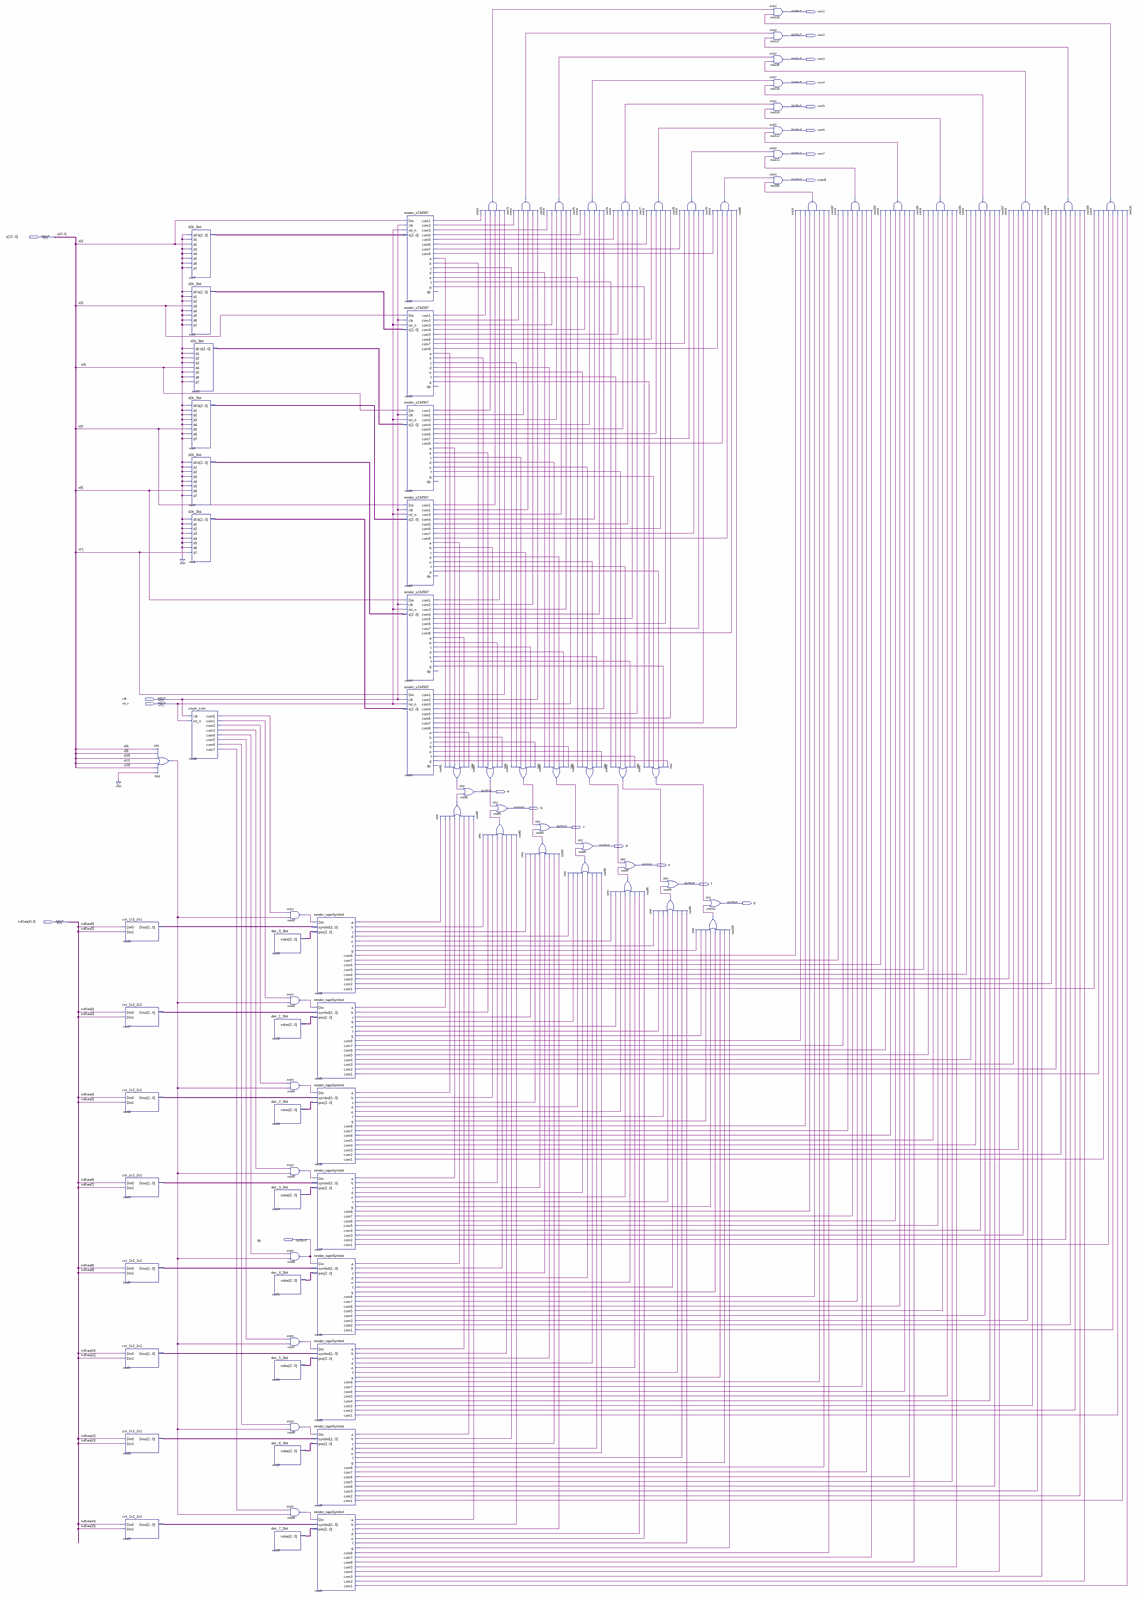
[diagram p0: schematic sheet, whole]
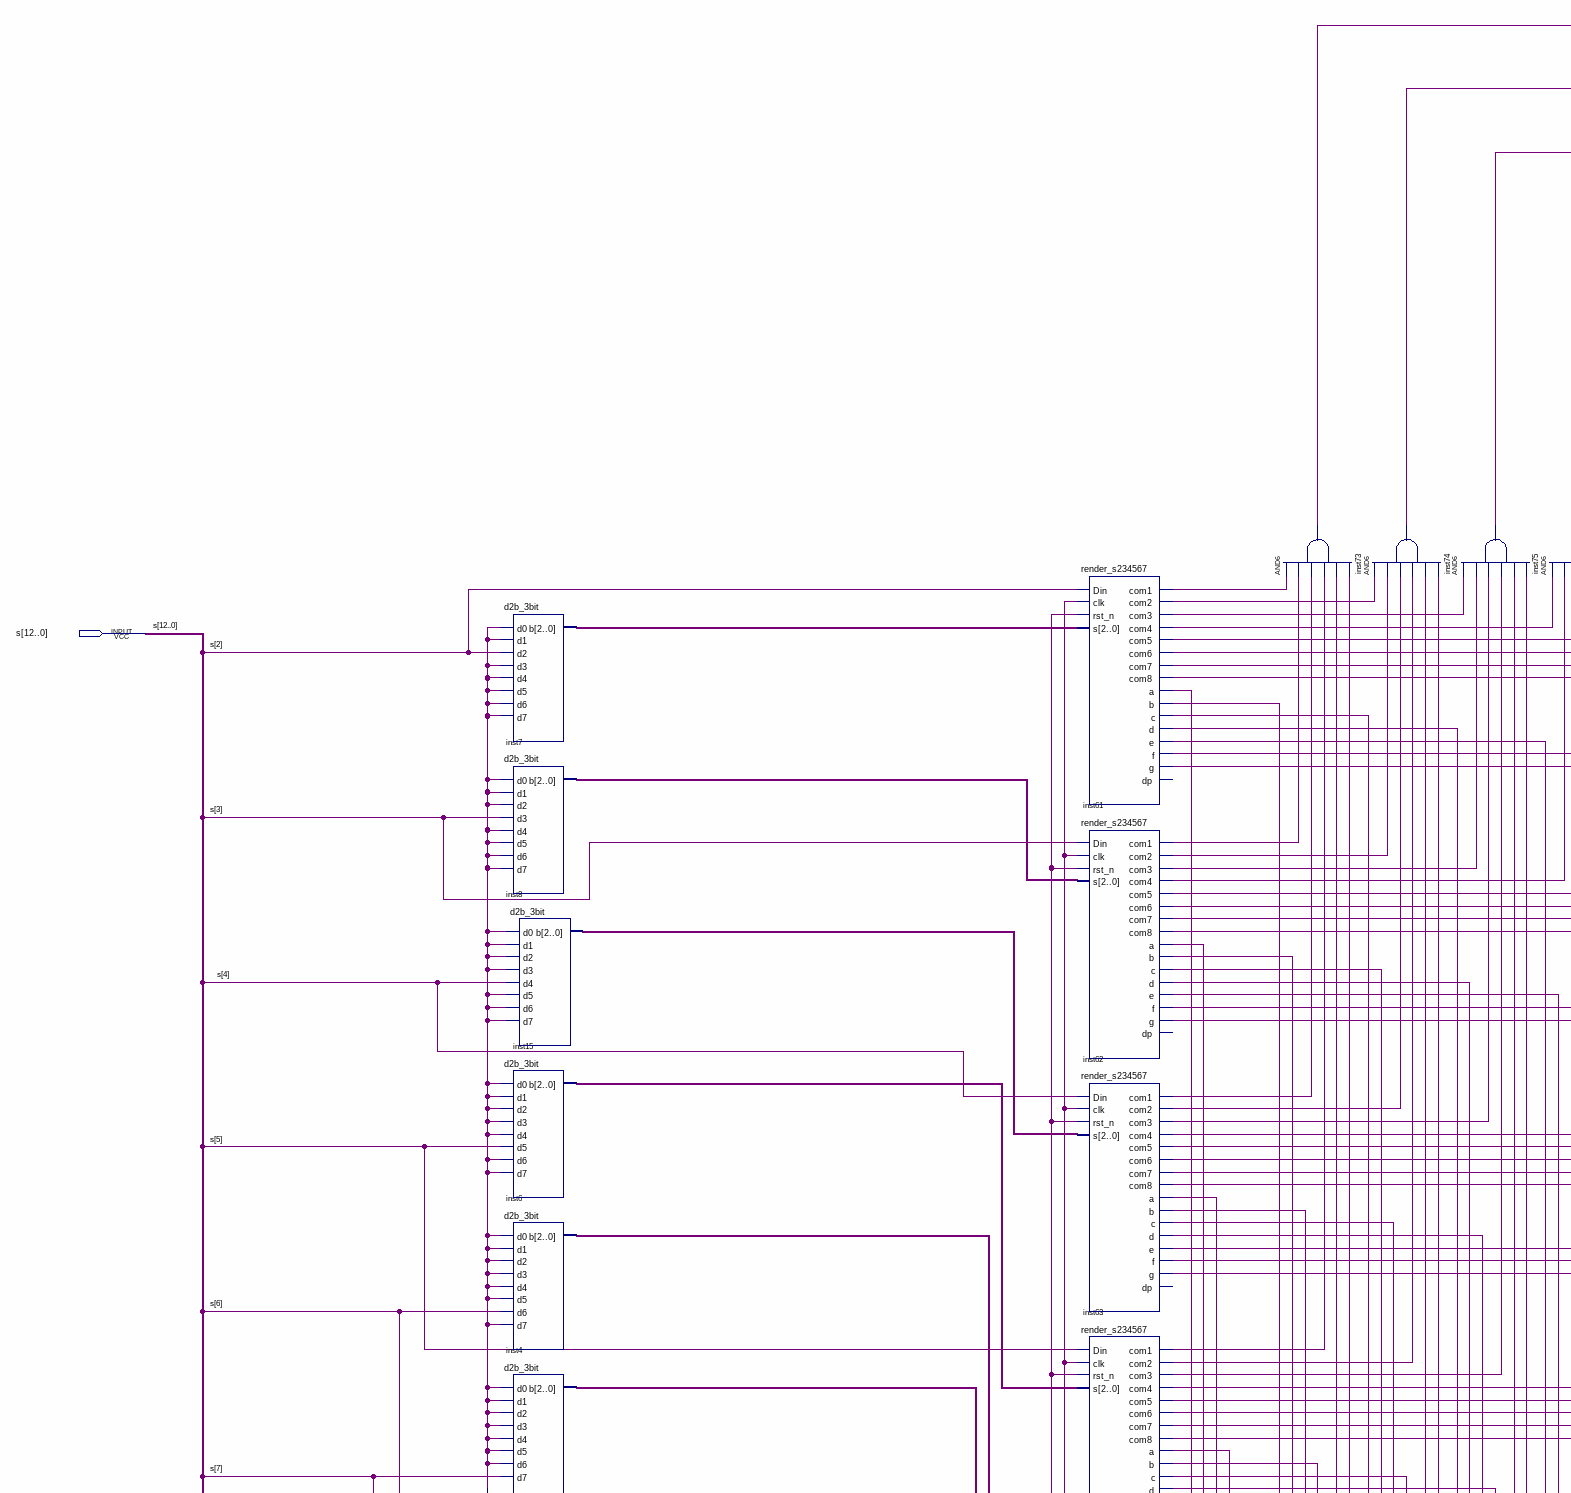
[diagram p1: schematic sheet, upper left part]
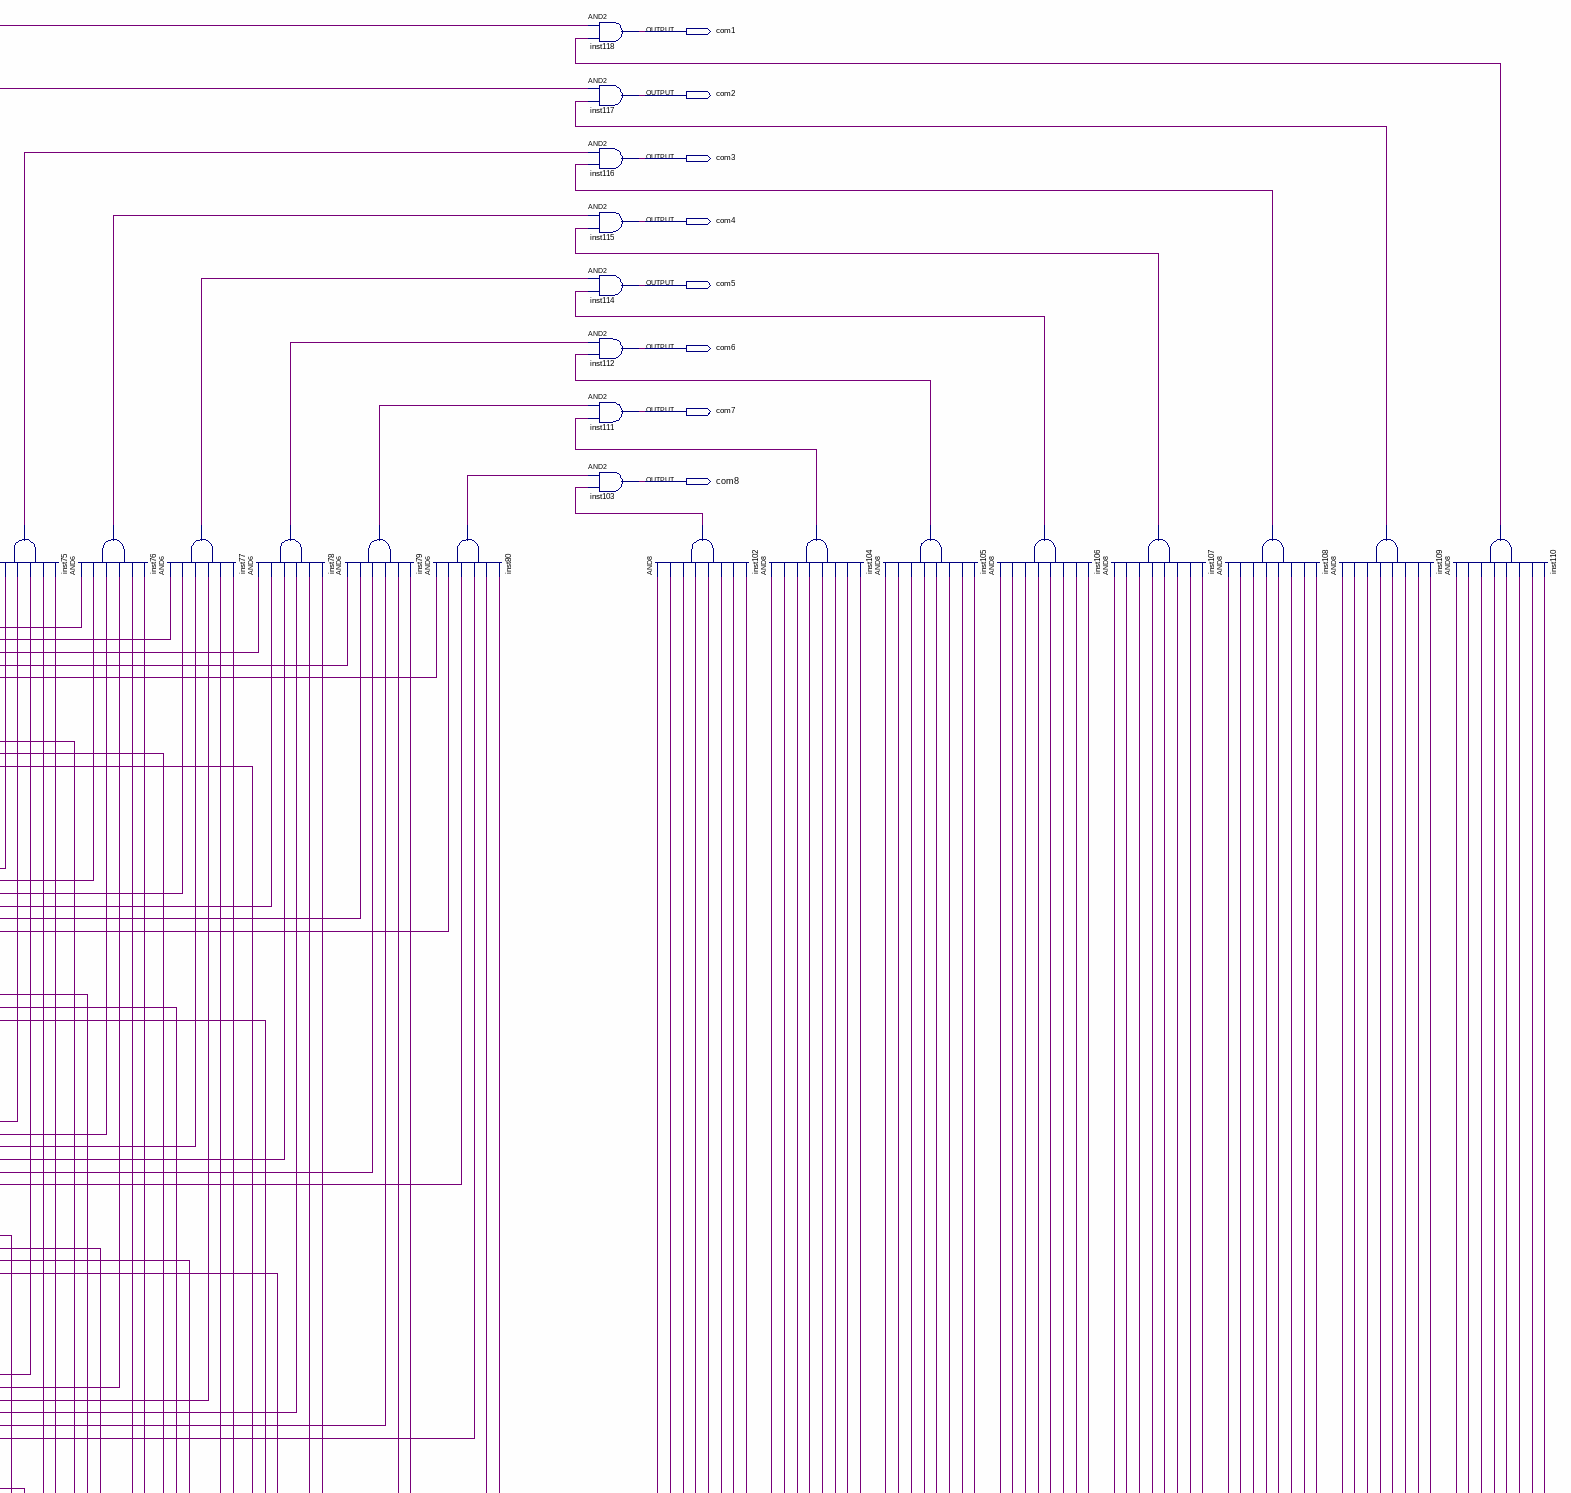
[diagram p2: schematic sheet, upper right part]
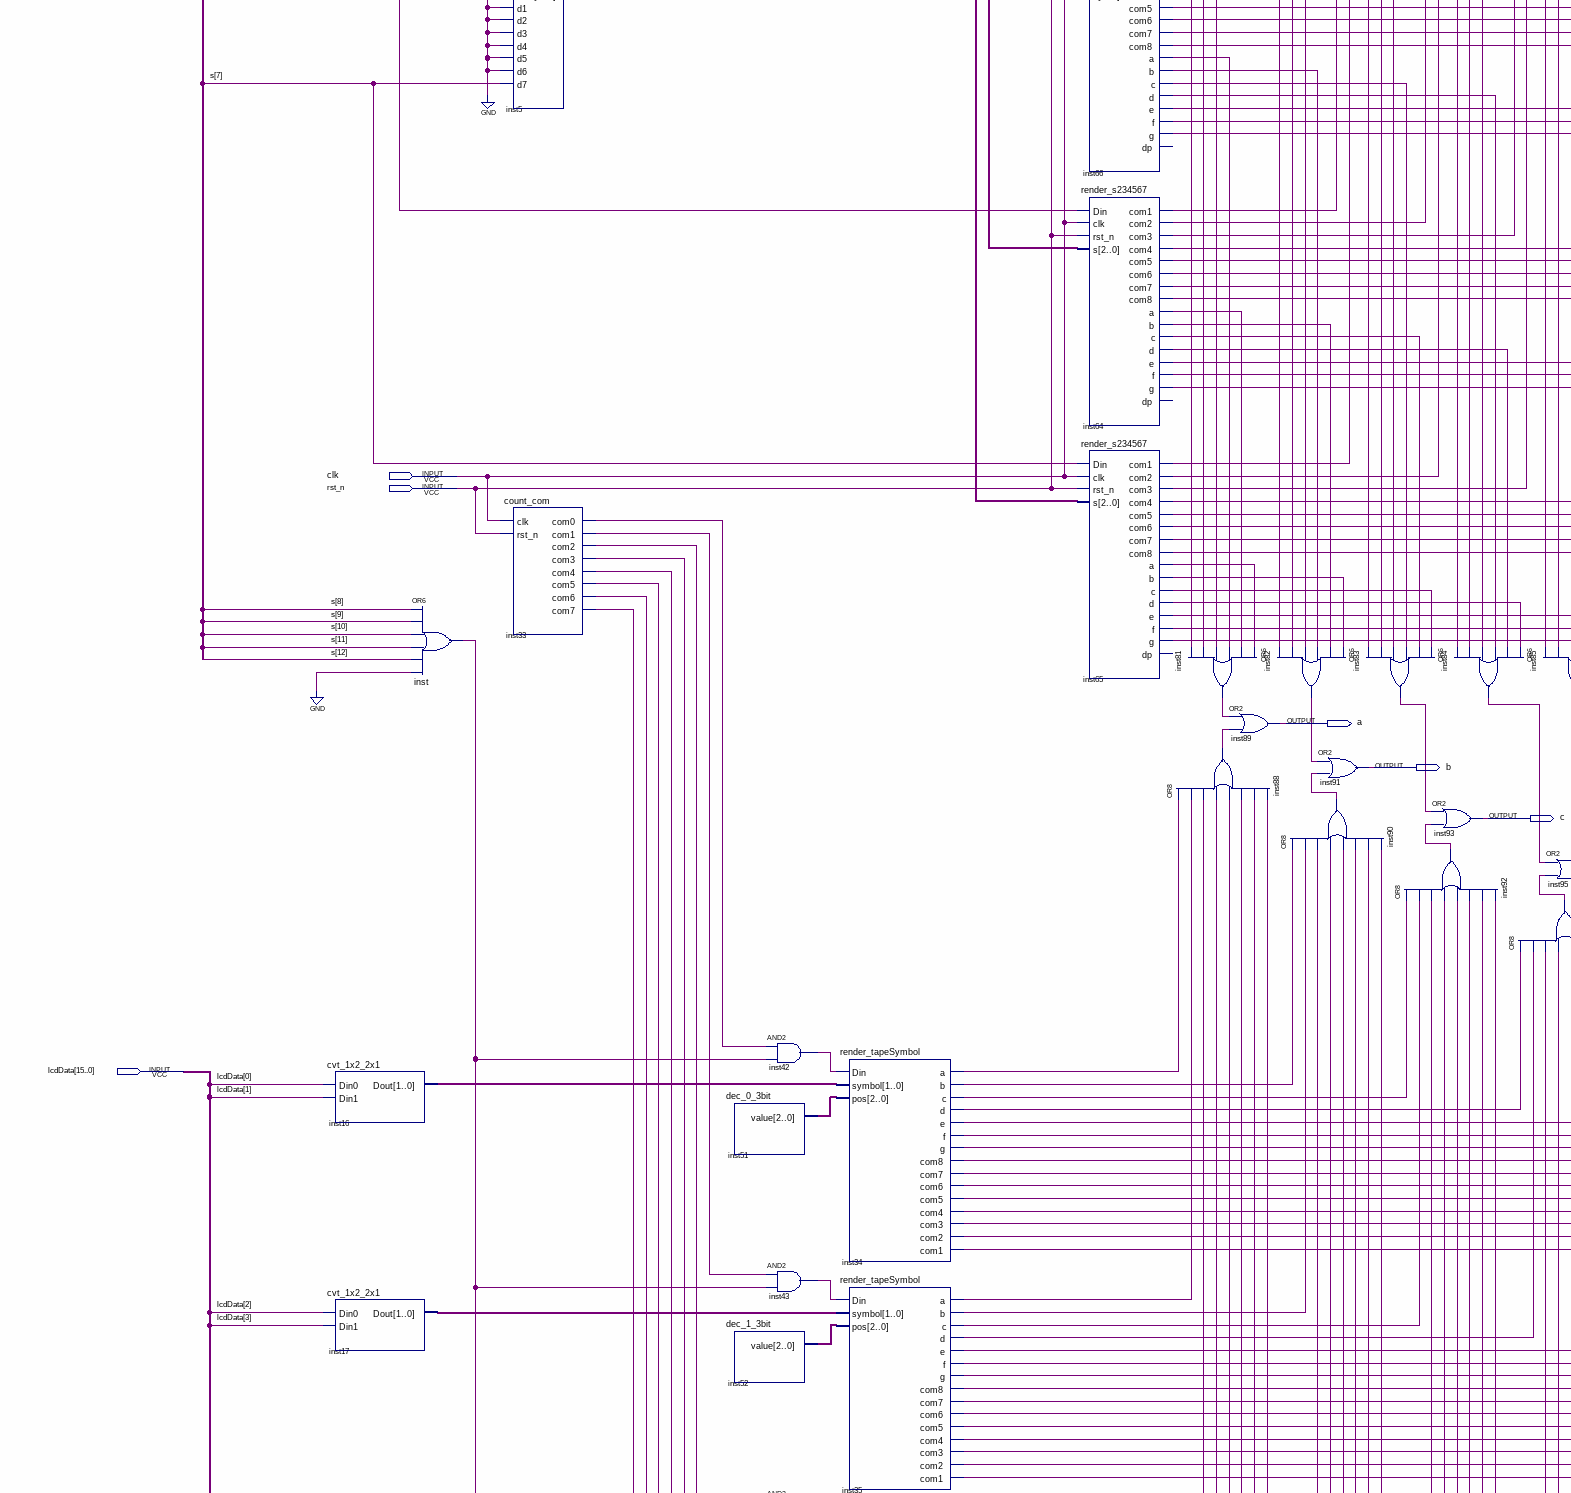
[diagram p3: schematic sheet, middle left part]
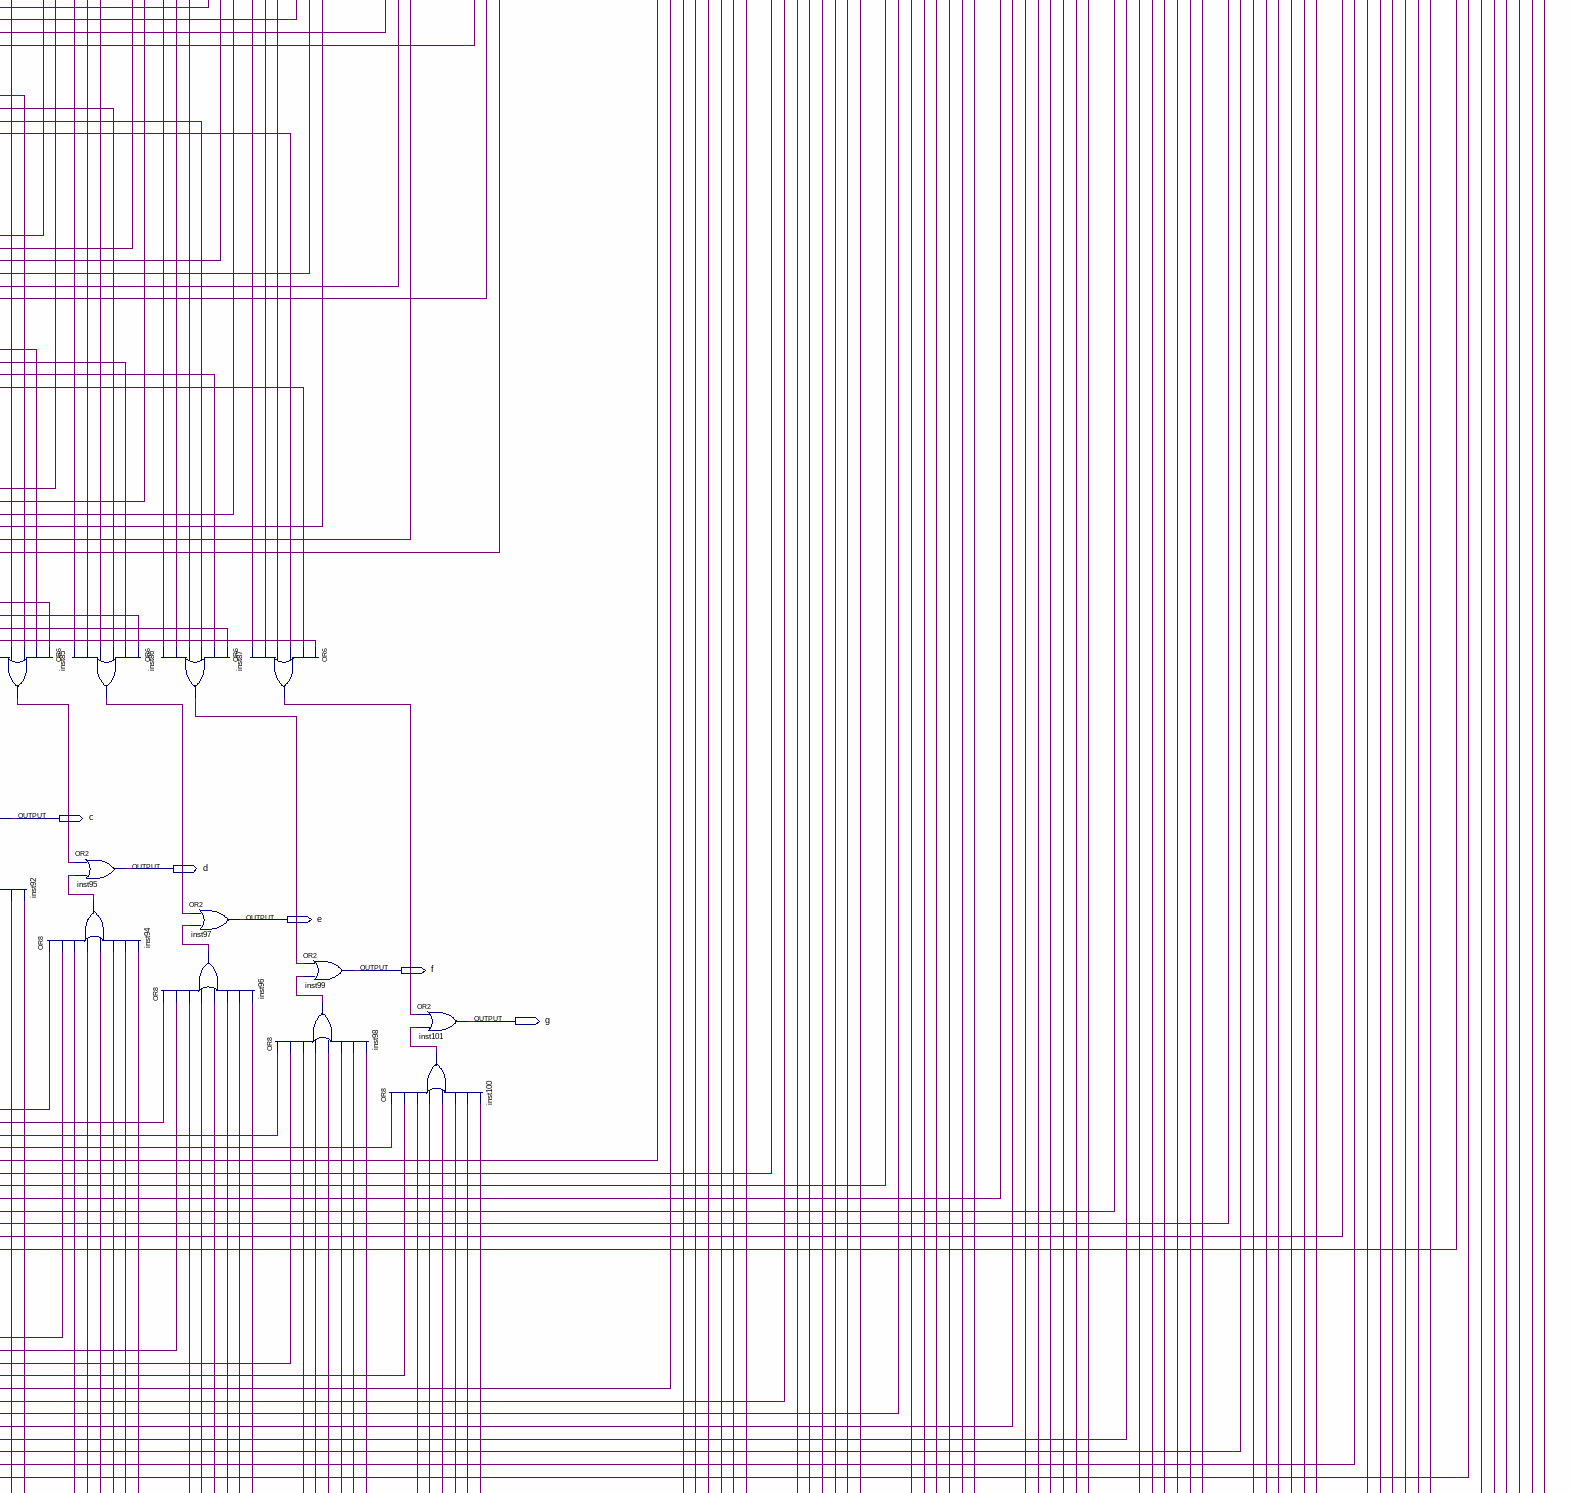
[diagram p4: schematic sheet, middle right part]
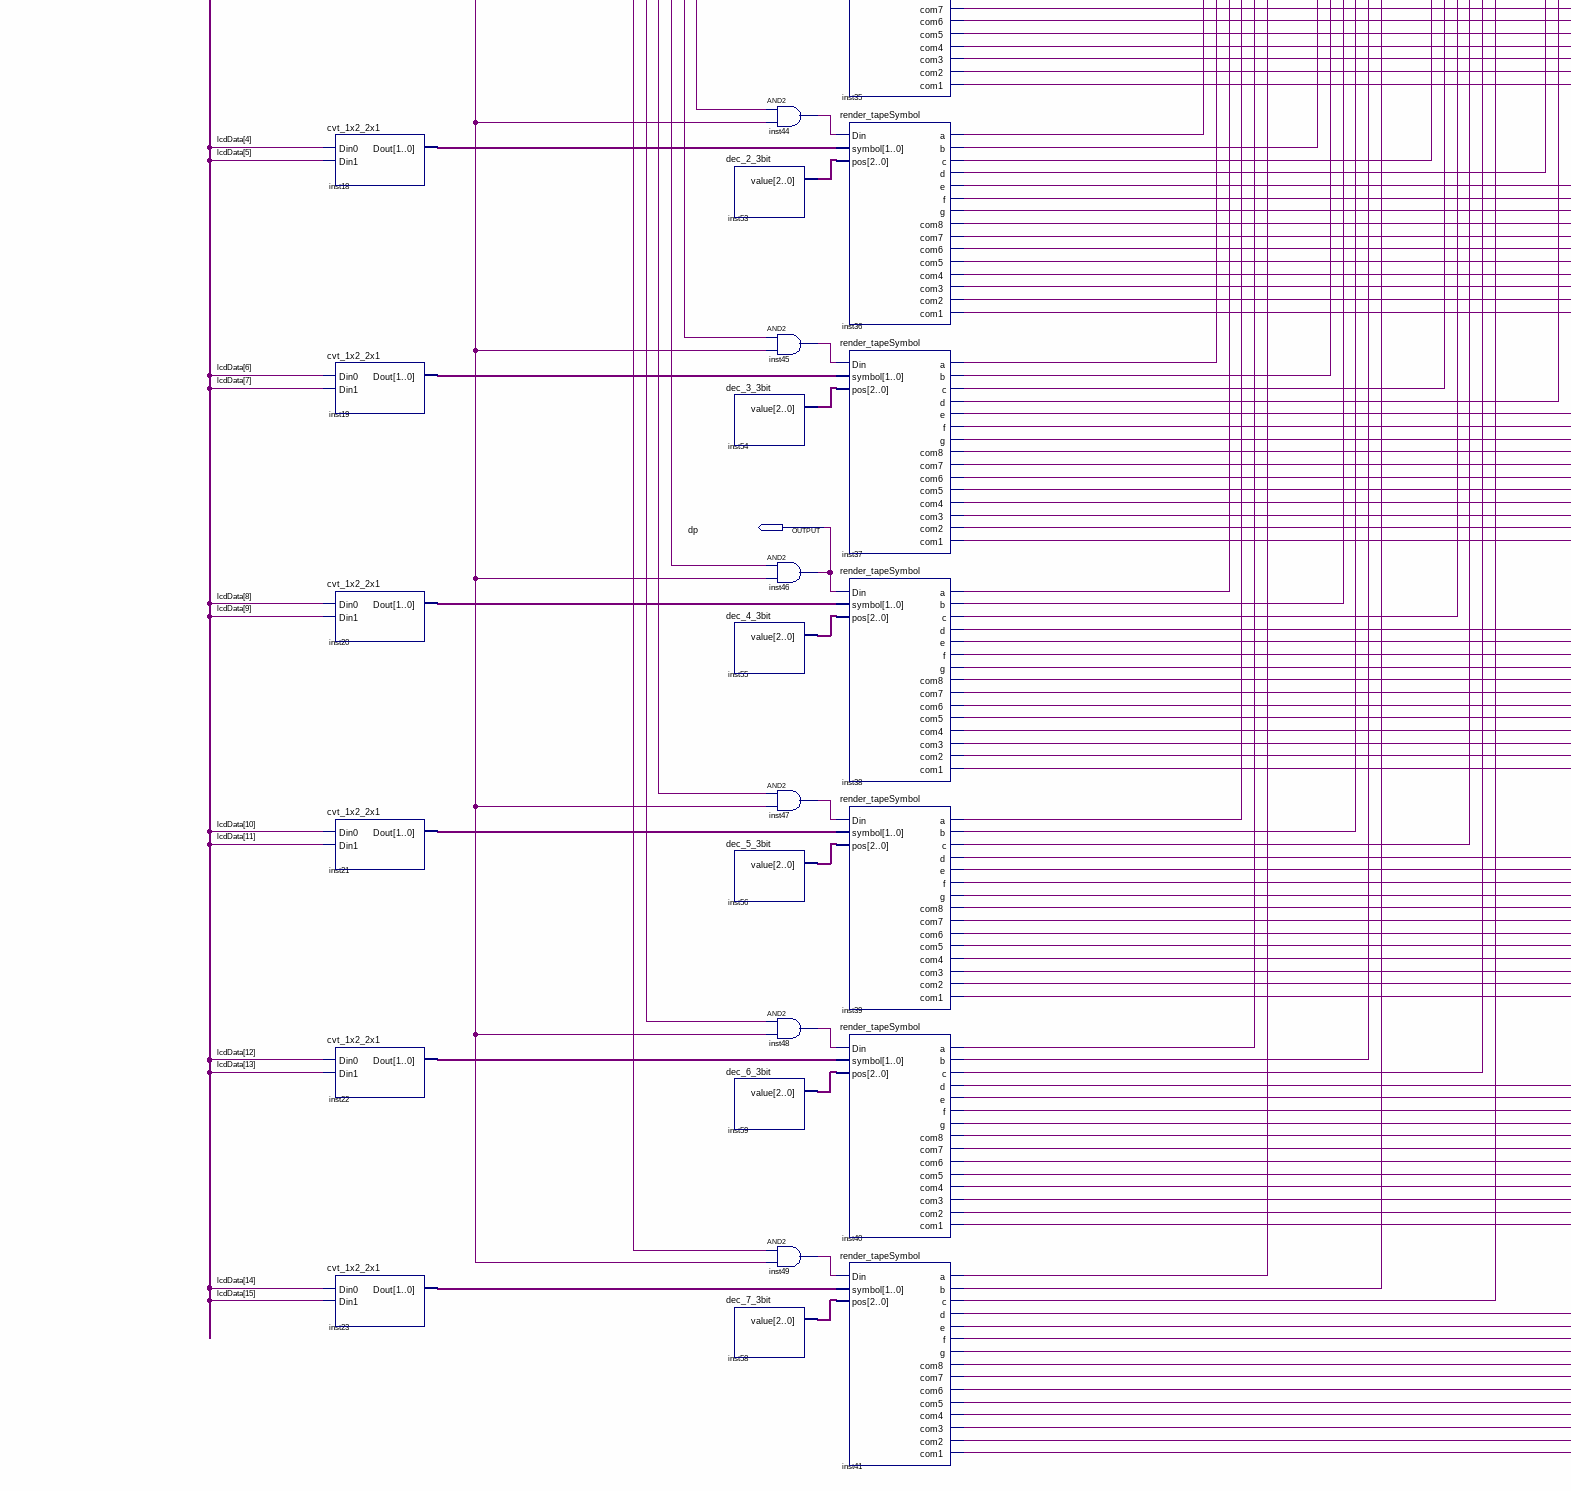
[diagram p5: schematic sheet, lower left part]
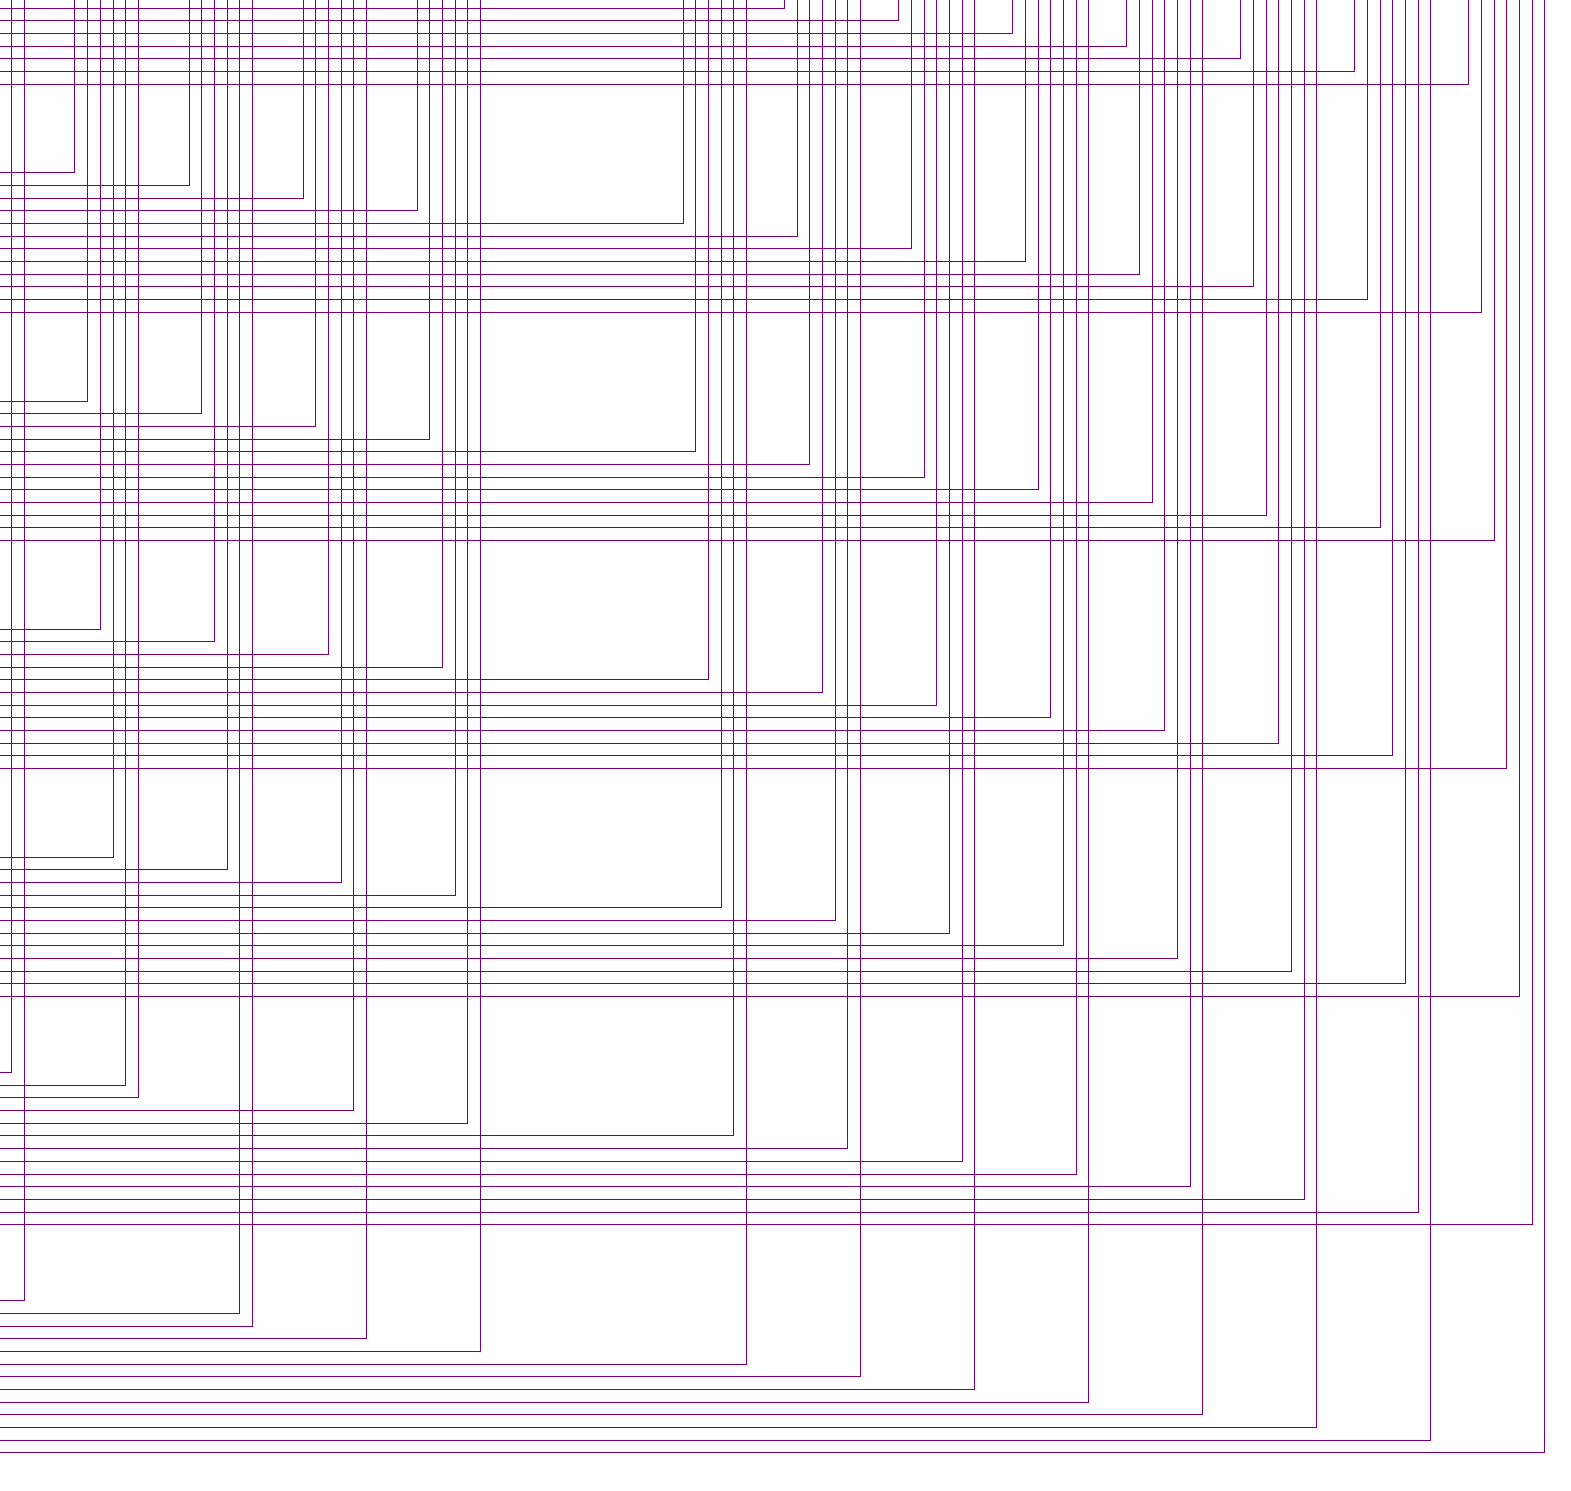
[diagram p6: schematic sheet, lower right part]
// Quartus schematic LCD.bdf as structural Verilog: 91 symbols, 20 pins
module LCD (
  input  [12:0] s,
  input  clk,
  input  rst_n,
  input  [15:0] lcdData,
  output com1,
  output com2,
  output com3,
  output com4,
  output com5,
  output com6,
  output com7,
  output com8,
  output a,
  output b,
  output c,
  output d,
  output e,
  output f,
  output g,
  output dp
);

  wire inst33_com0, inst33_com1, inst33_com2, inst33_com3, inst33_com4, inst33_com5, inst33_com6,
       inst33_com7, inst34_a, inst34_b, inst34_c, inst34_com1, inst34_com2, inst34_com3, inst34_com4,
       inst34_com5, inst34_com6, inst34_com7, inst34_com8, inst34_d, inst34_e, inst34_f, inst34_g, inst35_a,
       inst35_b, inst35_c, inst35_com1, inst35_com2, inst35_com3, inst35_com4, inst35_com5, inst35_com6,
       inst35_com7, inst35_com8, inst35_d, inst35_e, inst35_f, inst35_g, inst36_a, inst36_b, inst36_c,
       inst36_com1, inst36_com2, inst36_com3, inst36_com4, inst36_com5, inst36_com6, inst36_com7,
       inst36_com8, inst36_d, inst36_e, inst36_f, inst36_g, inst37_a, inst37_b, inst37_c, inst37_com1,
       inst37_com2, inst37_com3, inst37_com4, inst37_com5, inst37_com6, inst37_com7, inst37_com8, inst37_d,
       inst37_e, inst37_f, inst37_g, inst38_a, inst38_b, inst38_c, inst38_com1, inst38_com2, inst38_com3,
       inst38_com4, inst38_com5, inst38_com6, inst38_com7, inst38_com8, inst38_d, inst38_e, inst38_f,
       inst38_g, inst39_a, inst39_b, inst39_c, inst39_com1, inst39_com2, inst39_com3, inst39_com4,
       inst39_com5, inst39_com6, inst39_com7, inst39_com8, inst39_d, inst39_e, inst39_f, inst39_g, inst40_a,
       inst40_b, inst40_c, inst40_com1, inst40_com2, inst40_com3, inst40_com4, inst40_com5, inst40_com6,
       inst40_com7, inst40_com8, inst40_d, inst40_e, inst40_f, inst40_g, inst41_a, inst41_b, inst41_c,
       inst41_com1, inst41_com2, inst41_com3, inst41_com4, inst41_com5, inst41_com6, inst41_com7,
       inst41_com8, inst41_d, inst41_e, inst41_f, inst41_g, inst42_out, inst43_out, inst44_out, inst45_out,
       inst47_out, inst48_out, inst49_out, inst61_a, inst61_b, inst61_c, inst61_com1, inst61_com2,
       inst61_com3, inst61_com4, inst61_com5, inst61_com6, inst61_com7, inst61_com8, inst61_d, inst61_e,
       inst61_f, inst61_g, inst62_a, inst62_b, inst62_c, inst62_com1, inst62_com2, inst62_com3, inst62_com4,
       inst62_com5, inst62_com6, inst62_com7, inst62_com8, inst62_d, inst62_e, inst62_f, inst62_g, inst63_a,
       inst63_b, inst63_c, inst63_com1, inst63_com2, inst63_com3, inst63_com4, inst63_com5, inst63_com6,
       inst63_com7, inst63_com8, inst63_d, inst63_e, inst63_f, inst63_g, inst64_a, inst64_b, inst64_c,
       inst64_com1, inst64_com2, inst64_com3, inst64_com4, inst64_com5, inst64_com6, inst64_com7,
       inst64_com8, inst64_d, inst64_e, inst64_f, inst64_g, inst65_a, inst65_b, inst65_c, inst65_com1,
       inst65_com2, inst65_com3, inst65_com4, inst65_com5, inst65_com6, inst65_com7, inst65_com8, inst65_d,
       inst65_e, inst65_f, inst65_g, inst66_a, inst66_b, inst66_c, inst66_com1, inst66_com2, inst66_com3,
       inst66_com4, inst66_com5, inst66_com6, inst66_com7, inst66_com8, inst66_d, inst66_e, inst66_f,
       inst66_g, inst73_out, inst74_out, inst75_out, inst76_out, inst77_out, inst78_out, inst79_out,
       inst80_out, inst81_out, inst82_out, inst83_out, inst84_out, inst85_out, inst86_out, inst87_out,
       inst88_out, inst90_out, inst92_out, inst94_out, inst96_out, inst98_out, inst100_out, inst102_out,
       inst104_out, inst105_out, inst106_out, inst107_out, inst108_out, inst109_out, inst110_out, inst_out;
  wire [1:0] inst16_dout, inst17_dout, inst18_dout, inst19_dout, inst20_dout, inst21_dout, inst22_dout,
       inst23_dout;
  wire [2:0] inst4_b, inst5_b, inst6_b, inst7_b, inst8_b, inst15_b, inst51_value, inst52_value, inst53_value,
       inst54_value, inst55_value, inst56_value, inst58_value, inst59_value;

  cvt_1x2_2x1 inst16 (.Din0(lcdData[0]), .Din1(lcdData[1]), .Dout(inst16_dout));
  cvt_1x2_2x1 inst17 (.Din0(lcdData[2]), .Din1(lcdData[3]), .Dout(inst17_dout));
  cvt_1x2_2x1 inst18 (.Din0(lcdData[4]), .Din1(lcdData[5]), .Dout(inst18_dout));
  cvt_1x2_2x1 inst19 (.Din0(lcdData[6]), .Din1(lcdData[7]), .Dout(inst19_dout));
  cvt_1x2_2x1 inst20 (.Din0(lcdData[8]), .Din1(lcdData[9]), .Dout(inst20_dout));
  cvt_1x2_2x1 inst21 (.Din0(lcdData[10]), .Din1(lcdData[11]), .Dout(inst21_dout));
  cvt_1x2_2x1 inst22 (.Din0(lcdData[12]), .Din1(lcdData[13]), .Dout(inst22_dout));
  cvt_1x2_2x1 inst23 (.Din0(lcdData[14]), .Din1(lcdData[15]), .Dout(inst23_dout));
  or inst (inst_out, s[8], s[9], s[10], s[11], s[12], 1'b0);
  d2b_3bit inst7 (.d0(1'b0), .d1(1'b0), .d2(s[2]), .d3(1'b0), .d4(1'b0), .d5(1'b0), .d6(1'b0), .d7(1'b0), .b(inst7_b));
  d2b_3bit inst8 (.d0(1'b0), .d1(1'b0), .d2(1'b0), .d3(s[3]), .d4(1'b0), .d5(1'b0), .d6(1'b0), .d7(1'b0), .b(inst8_b));
  d2b_3bit inst15 (
    .d0(1'b0), .d1(1'b0), .d2(1'b0), .d3(1'b0), .d4(s[4]), .d5(1'b0), .d6(1'b0), .d7(1'b0), .b(inst15_b));
  d2b_3bit inst6 (.d0(1'b0), .d1(1'b0), .d2(1'b0), .d3(1'b0), .d4(1'b0), .d5(s[5]), .d6(1'b0), .d7(1'b0), .b(inst6_b));
  d2b_3bit inst4 (.d0(1'b0), .d1(1'b0), .d2(1'b0), .d3(1'b0), .d4(1'b0), .d5(1'b0), .d6(s[6]), .d7(1'b0), .b(inst4_b));
  d2b_3bit inst5 (.d0(1'b0), .d1(1'b0), .d2(1'b0), .d3(1'b0), .d4(1'b0), .d5(1'b0), .d6(1'b0), .d7(s[7]), .b(inst5_b));
  count_com inst33 (
    .clk(clk), .rst_n(rst_n), .com0(inst33_com0), .com1(inst33_com1), .com2(inst33_com2), .com3(inst33_com3),
    .com4(inst33_com4), .com5(inst33_com5), .com6(inst33_com6), .com7(inst33_com7));
  dec_0_3bit inst51 (.value(inst51_value));
  dec_1_3bit inst52 (.value(inst52_value));
  dec_2_3bit inst53 (.value(inst53_value));
  dec_3_3bit inst54 (.value(inst54_value));
  dec_4_3bit inst55 (.value(inst55_value));
  dec_5_3bit inst56 (.value(inst56_value));
  dec_6_3bit inst59 (.value(inst59_value));
  dec_7_3bit inst58 (.value(inst58_value));
  and inst42 (inst42_out, inst33_com0, inst_out);
  and inst43 (inst43_out, inst33_com1, inst_out);
  and inst44 (inst44_out, inst33_com2, inst_out);
  and inst45 (inst45_out, inst33_com3, inst_out);
  and inst46 (dp, inst33_com4, inst_out);
  and inst47 (inst47_out, inst33_com5, inst_out);
  and inst48 (inst48_out, inst33_com6, inst_out);
  and inst49 (inst49_out, inst33_com7, inst_out);
  render_tapeSymbol inst34 (
    .Din(inst42_out), .symbol(inst16_dout), .pos(inst51_value), .a(inst34_a), .b(inst34_b), .c(inst34_c),
    .d(inst34_d), .e(inst34_e), .f(inst34_f), .g(inst34_g), .com8(inst34_com8), .com7(inst34_com7),
    .com6(inst34_com6), .com5(inst34_com5), .com4(inst34_com4), .com3(inst34_com3), .com2(inst34_com2),
    .com1(inst34_com1));
  render_tapeSymbol inst35 (
    .Din(inst43_out), .symbol(inst17_dout), .pos(inst52_value), .a(inst35_a), .b(inst35_b), .c(inst35_c),
    .d(inst35_d), .e(inst35_e), .f(inst35_f), .g(inst35_g), .com8(inst35_com8), .com7(inst35_com7),
    .com6(inst35_com6), .com5(inst35_com5), .com4(inst35_com4), .com3(inst35_com3), .com2(inst35_com2),
    .com1(inst35_com1));
  render_tapeSymbol inst36 (
    .Din(inst44_out), .symbol(inst18_dout), .pos(inst53_value), .a(inst36_a), .b(inst36_b), .c(inst36_c),
    .d(inst36_d), .e(inst36_e), .f(inst36_f), .g(inst36_g), .com8(inst36_com8), .com7(inst36_com7),
    .com6(inst36_com6), .com5(inst36_com5), .com4(inst36_com4), .com3(inst36_com3), .com2(inst36_com2),
    .com1(inst36_com1));
  render_tapeSymbol inst37 (
    .Din(inst45_out), .symbol(inst19_dout), .pos(inst54_value), .a(inst37_a), .b(inst37_b), .c(inst37_c),
    .d(inst37_d), .e(inst37_e), .f(inst37_f), .g(inst37_g), .com8(inst37_com8), .com7(inst37_com7),
    .com6(inst37_com6), .com5(inst37_com5), .com4(inst37_com4), .com3(inst37_com3), .com2(inst37_com2),
    .com1(inst37_com1));
  render_tapeSymbol inst38 (
    .Din(dp), .symbol(inst20_dout), .pos(inst55_value), .a(inst38_a), .b(inst38_b), .c(inst38_c),
    .d(inst38_d), .e(inst38_e), .f(inst38_f), .g(inst38_g), .com8(inst38_com8), .com7(inst38_com7),
    .com6(inst38_com6), .com5(inst38_com5), .com4(inst38_com4), .com3(inst38_com3), .com2(inst38_com2),
    .com1(inst38_com1));
  render_tapeSymbol inst39 (
    .Din(inst47_out), .symbol(inst21_dout), .pos(inst56_value), .a(inst39_a), .b(inst39_b), .c(inst39_c),
    .d(inst39_d), .e(inst39_e), .f(inst39_f), .g(inst39_g), .com8(inst39_com8), .com7(inst39_com7),
    .com6(inst39_com6), .com5(inst39_com5), .com4(inst39_com4), .com3(inst39_com3), .com2(inst39_com2),
    .com1(inst39_com1));
  render_tapeSymbol inst40 (
    .Din(inst48_out), .symbol(inst22_dout), .pos(inst59_value), .a(inst40_a), .b(inst40_b), .c(inst40_c),
    .d(inst40_d), .e(inst40_e), .f(inst40_f), .g(inst40_g), .com8(inst40_com8), .com7(inst40_com7),
    .com6(inst40_com6), .com5(inst40_com5), .com4(inst40_com4), .com3(inst40_com3), .com2(inst40_com2),
    .com1(inst40_com1));
  render_tapeSymbol inst41 (
    .Din(inst49_out), .symbol(inst23_dout), .pos(inst58_value), .a(inst41_a), .b(inst41_b), .c(inst41_c),
    .d(inst41_d), .e(inst41_e), .f(inst41_f), .g(inst41_g), .com8(inst41_com8), .com7(inst41_com7),
    .com6(inst41_com6), .com5(inst41_com5), .com4(inst41_com4), .com3(inst41_com3), .com2(inst41_com2),
    .com1(inst41_com1));
  render_s234567 inst61 (
    .Din(s[2]), .clk(clk), .rst_n(rst_n), .s(inst7_b), .com1(inst61_com1), .com2(inst61_com2),
    .com3(inst61_com3), .com4(inst61_com4), .com5(inst61_com5), .com6(inst61_com6), .com7(inst61_com7),
    .com8(inst61_com8), .a(inst61_a), .b(inst61_b), .c(inst61_c), .d(inst61_d), .e(inst61_e), .f(inst61_f),
    .g(inst61_g));  // open: dp
  render_s234567 inst62 (
    .Din(s[3]), .clk(clk), .rst_n(rst_n), .s(inst8_b), .com1(inst62_com1), .com2(inst62_com2),
    .com3(inst62_com3), .com4(inst62_com4), .com5(inst62_com5), .com6(inst62_com6), .com7(inst62_com7),
    .com8(inst62_com8), .a(inst62_a), .b(inst62_b), .c(inst62_c), .d(inst62_d), .e(inst62_e), .f(inst62_f),
    .g(inst62_g));  // open: dp
  render_s234567 inst63 (
    .Din(s[4]), .clk(clk), .rst_n(rst_n), .s(inst15_b), .com1(inst63_com1), .com2(inst63_com2),
    .com3(inst63_com3), .com4(inst63_com4), .com5(inst63_com5), .com6(inst63_com6), .com7(inst63_com7),
    .com8(inst63_com8), .a(inst63_a), .b(inst63_b), .c(inst63_c), .d(inst63_d), .e(inst63_e), .f(inst63_f),
    .g(inst63_g));  // open: dp
  render_s234567 inst66 (
    .Din(s[5]), .clk(clk), .rst_n(rst_n), .s(inst6_b), .com1(inst66_com1), .com2(inst66_com2),
    .com3(inst66_com3), .com4(inst66_com4), .com5(inst66_com5), .com6(inst66_com6), .com7(inst66_com7),
    .com8(inst66_com8), .a(inst66_a), .b(inst66_b), .c(inst66_c), .d(inst66_d), .e(inst66_e), .f(inst66_f),
    .g(inst66_g));  // open: dp
  render_s234567 inst64 (
    .Din(s[6]), .clk(clk), .rst_n(rst_n), .s(inst4_b), .com1(inst64_com1), .com2(inst64_com2),
    .com3(inst64_com3), .com4(inst64_com4), .com5(inst64_com5), .com6(inst64_com6), .com7(inst64_com7),
    .com8(inst64_com8), .a(inst64_a), .b(inst64_b), .c(inst64_c), .d(inst64_d), .e(inst64_e), .f(inst64_f),
    .g(inst64_g));  // open: dp
  render_s234567 inst65 (
    .Din(s[7]), .clk(clk), .rst_n(rst_n), .s(inst5_b), .com1(inst65_com1), .com2(inst65_com2),
    .com3(inst65_com3), .com4(inst65_com4), .com5(inst65_com5), .com6(inst65_com6), .com7(inst65_com7),
    .com8(inst65_com8), .a(inst65_a), .b(inst65_b), .c(inst65_c), .d(inst65_d), .e(inst65_e), .f(inst65_f),
    .g(inst65_g));  // open: dp
  or inst88 (inst88_out, inst34_a, inst35_a, inst36_a, inst37_a, inst38_a, inst39_a, inst40_a, inst41_a);
  or inst81 (inst81_out, inst65_a, inst64_a, inst66_a, inst63_a, inst62_a, inst61_a);
  or inst82 (inst82_out, inst65_b, inst64_b, inst66_b, inst63_b, inst62_b, inst61_b);
  or inst89 (a, inst81_out, inst88_out);
  and inst73 (inst73_out, inst61_com1, inst62_com1, inst63_com1, inst66_com1, inst64_com1, inst65_com1);
  or inst91 (b, inst82_out, inst90_out);
  or inst90 (inst90_out, inst34_b, inst35_b, inst36_b, inst37_b, inst38_b, inst39_b, inst40_b, inst41_b);
  and inst74 (inst74_out, inst61_com2, inst62_com2, inst63_com2, inst66_com2, inst64_com2, inst65_com2);
  or inst83 (inst83_out, inst65_c, inst64_c, inst66_c, inst63_c, inst62_c, inst61_c);
  or inst92 (inst92_out, inst34_c, inst35_c, inst36_c, inst37_c, inst38_c, inst39_c, inst40_c, inst41_c);
  and inst75 (inst75_out, inst61_com3, inst62_com3, inst63_com3, inst66_com3, inst64_com3, inst65_com3);
  or inst84 (inst84_out, inst65_d, inst64_d, inst66_d, inst63_d, inst62_d, inst61_d);
  or inst93 (c, inst83_out, inst92_out);
  or inst94 (inst94_out, inst34_d, inst35_d, inst36_d, inst37_d, inst38_d, inst39_d, inst40_d, inst40_e);
  and inst76 (inst76_out, inst61_com4, inst62_com4, inst63_com4, inst66_com4, inst64_com4, inst65_com4);
  or inst85 (inst85_out, inst65_e, inst64_e, inst66_e, inst63_e, inst62_e, inst61_e);
  or inst95 (d, inst84_out, inst94_out);
  or inst86 (inst86_out, inst65_f, inst64_f, inst66_f, inst63_f, inst62_f, inst61_f);
  or inst96 (inst96_out, inst34_e, inst35_e, inst36_e, inst37_e, inst38_e, inst39_e, inst41_d, inst41_e);
  and inst77 (inst77_out, inst61_com5, inst62_com5, inst63_com5, inst66_com5, inst64_com5, inst65_com5);
  or inst97 (e, inst85_out, inst96_out);
  and inst78 (inst78_out, inst61_com6, inst62_com6, inst63_com6, inst66_com6, inst64_com6, inst65_com6);
  or inst87 (inst87_out, inst65_g, inst64_g, inst66_g, inst63_g, inst62_g, inst61_g);
  or inst99 (f, inst86_out, inst98_out);
  or inst98 (inst98_out, inst34_f, inst35_f, inst36_f, inst37_f, inst38_f, inst39_f, inst40_f, inst41_f);
  and inst79 (inst79_out, inst61_com7, inst62_com7, inst63_com7, inst66_com7, inst64_com7, inst65_com7);
  or inst100 (inst100_out, inst34_g, inst35_g, inst36_g, inst37_g, inst38_g, inst39_g, inst40_g, inst41_g);
  and inst80 (inst80_out, inst61_com8, inst62_com8, inst63_com8, inst66_com8, inst64_com8, inst65_com8);
  or inst101 (g, inst87_out, inst100_out);
  and inst118 (com1, inst73_out, inst110_out);
  and inst117 (com2, inst74_out, inst109_out);
  and inst116 (com3, inst75_out, inst108_out);
  and inst115 (com4, inst76_out, inst107_out);
  and inst114 (com5, inst77_out, inst106_out);
  and inst112 (com6, inst78_out, inst105_out);
  and inst111 (com7, inst79_out, inst104_out);
  and inst103 (com8, inst80_out, inst102_out);
  and inst102 (inst102_out, inst34_com8, inst35_com8, inst36_com8, inst37_com8, inst38_com8, inst39_com8, inst40_com8, inst41_com8);
  and inst104 (inst104_out, inst34_com7, inst35_com7, inst36_com7, inst37_com7, inst38_com7, inst39_com7, inst40_com7, inst41_com7);
  and inst105 (inst105_out, inst34_com6, inst35_com6, inst36_com6, inst37_com6, inst38_com6, inst39_com6, inst40_com6, inst41_com6);
  and inst106 (inst106_out, inst34_com5, inst35_com5, inst36_com5, inst37_com5, inst38_com5, inst39_com5, inst40_com5, inst41_com5);
  and inst107 (inst107_out, inst34_com4, inst35_com4, inst36_com4, inst37_com4, inst38_com4, inst39_com4, inst40_com4, inst41_com4);
  and inst108 (inst108_out, inst34_com3, inst35_com3, inst36_com3, inst37_com3, inst38_com3, inst39_com3, inst40_com3, inst41_com3);
  and inst109 (inst109_out, inst34_com2, inst35_com2, inst36_com2, inst37_com2, inst38_com2, inst39_com2, inst40_com2, inst41_com2);
  and inst110 (inst110_out, inst34_com1, inst35_com1, inst36_com1, inst37_com1, inst38_com1, inst39_com1, inst40_com1, inst41_com1);
endmodule
